# Altium schematic sheet Sheet_1_2022-01-13.schdoc
size 448 x 395 mm
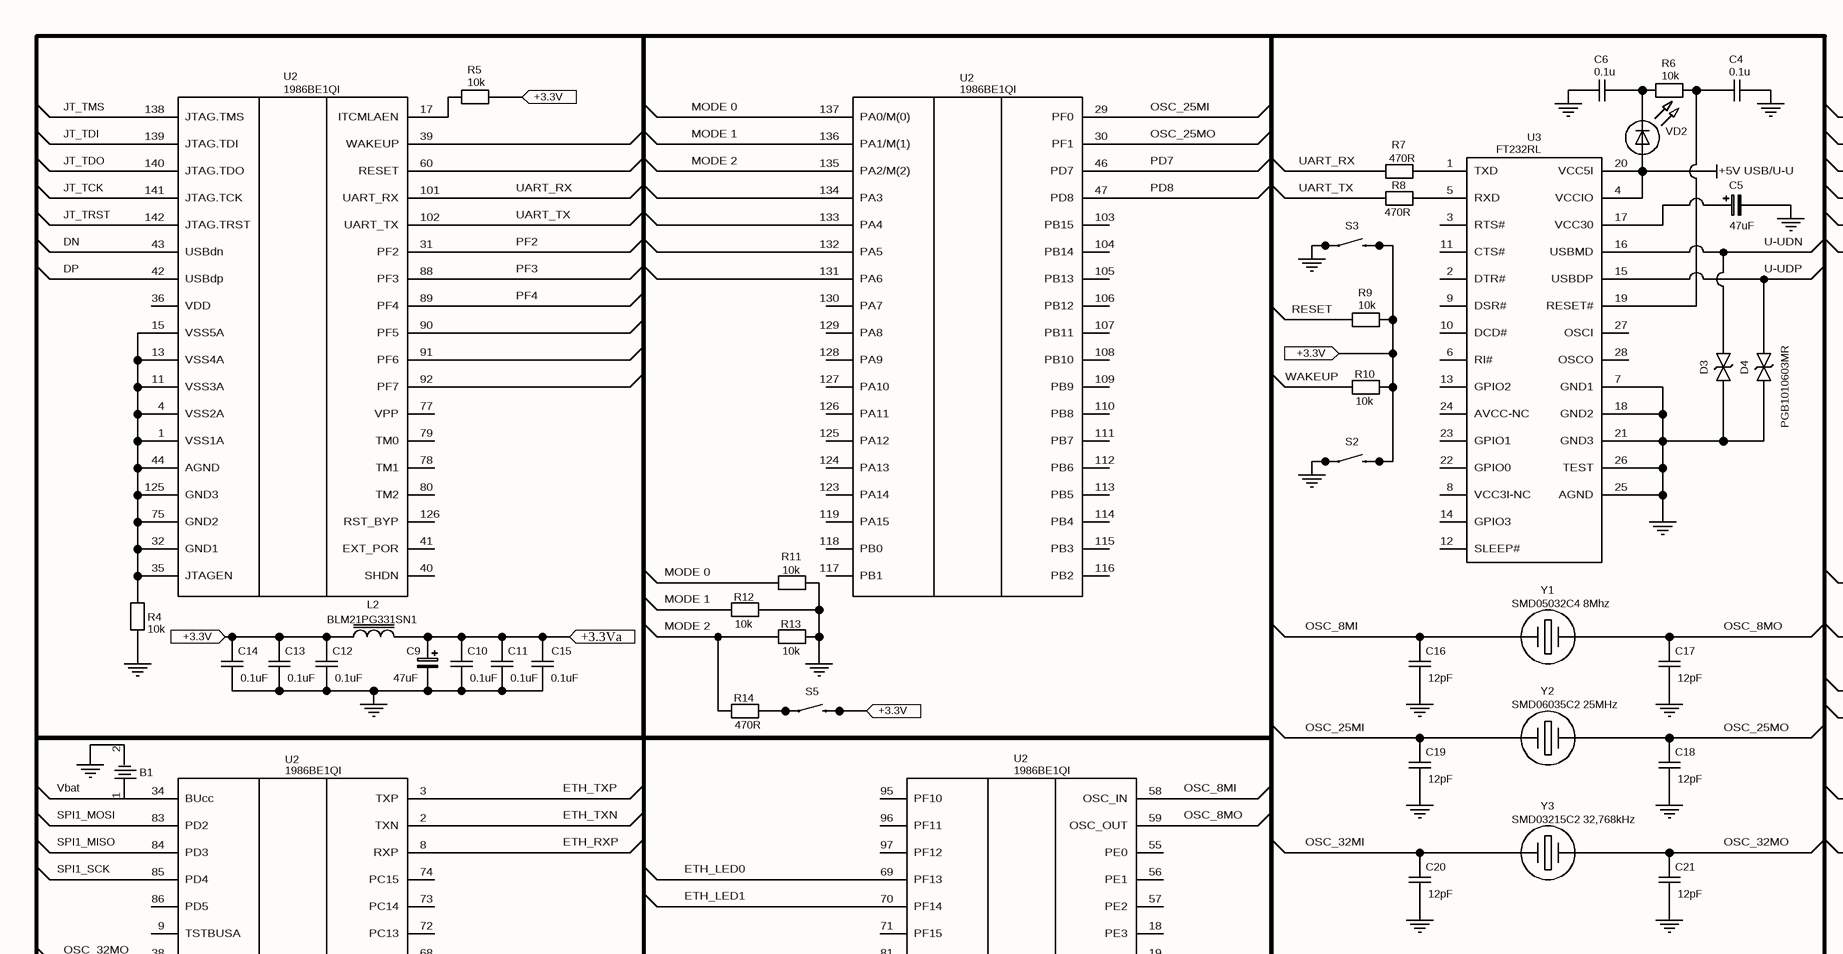
[diagram p0: Sheet_1_2022-01-13.schdoc, top left]
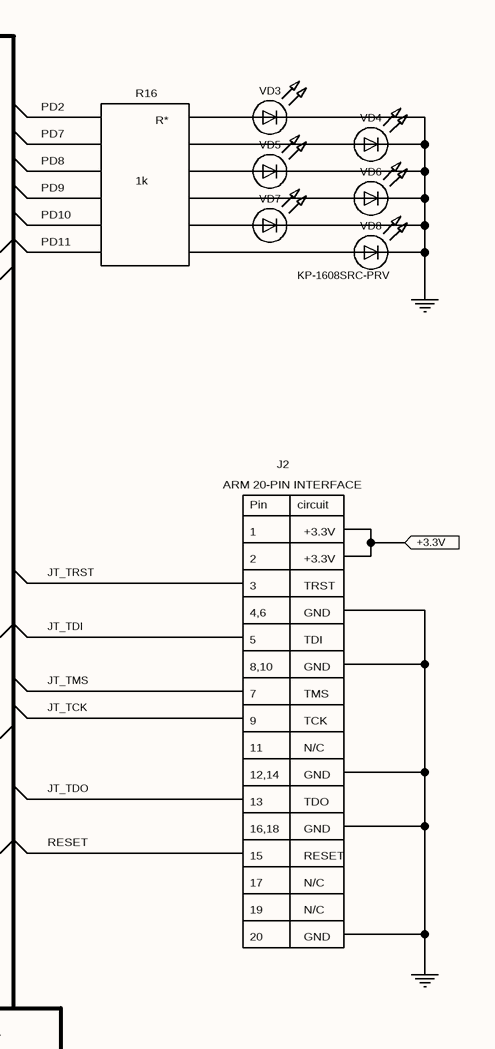
[diagram p1: Sheet_1_2022-01-13.schdoc, top right]
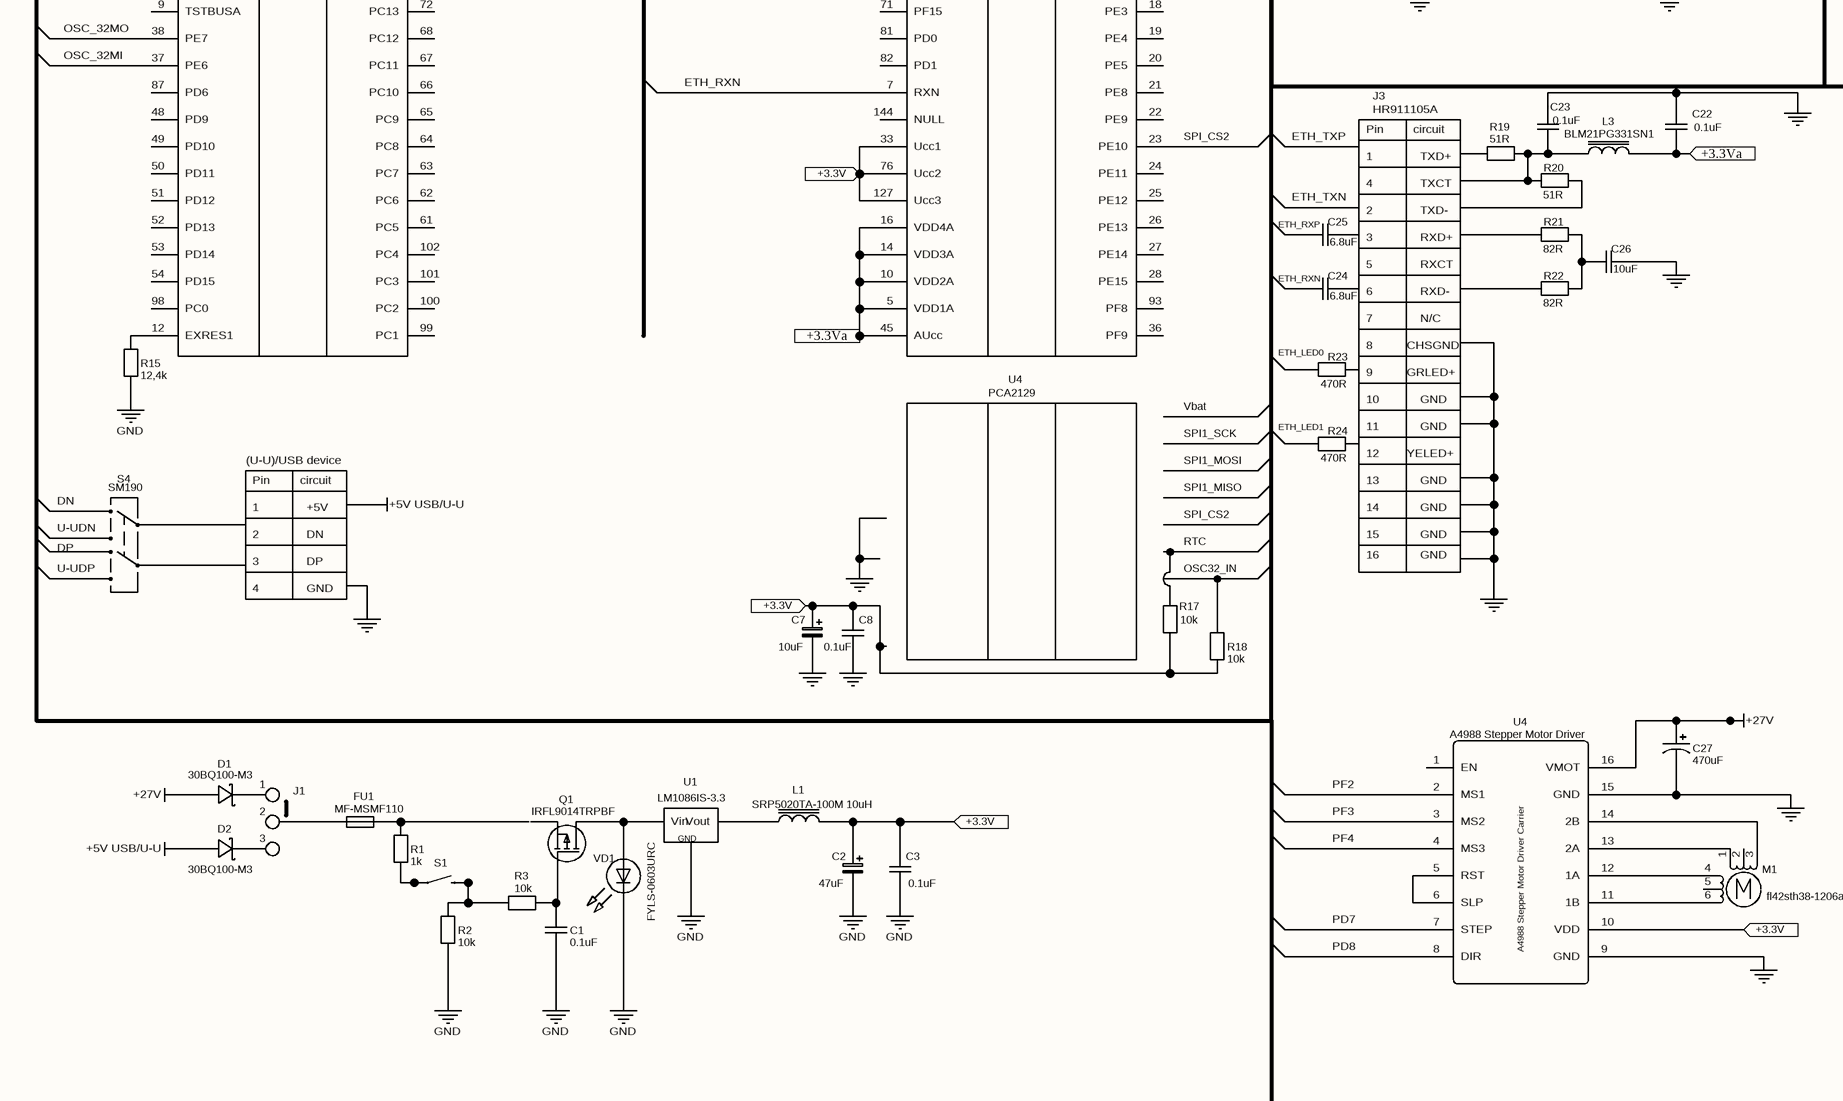
[diagram p2: Sheet_1_2022-01-13.schdoc, bottom left]
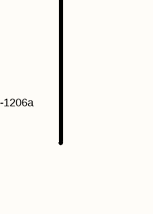
[diagram p3: Sheet_1_2022-01-13.schdoc, bottom right]

## Parts
(Parts that share a designator on the sheet are numbered #1, #2 ... from top to bottom, then left to right.)
B1  CR1220-2  [BAT-SMD_CR1220-2]  (value not drawn)
C1  0.1uF  [C0603]
C2  47uF  [CASE-A_3216]
C3  0.1uF  [C0603]
C4  0.1u  [C0603]
C5  47uF  [CASE-A_3216]
C6  0.1u  [C0603]
C7  10uF  [CASE-A_3216]
C8  0.1uF  [C0603]
C9  47uF  [CASE-A_3216]
C10  0.1uF  [C0603]
C11  0.1uF  [C0603]
C12  0.1uF  [C0603]
C13  0.1uF  [C0603]
C14  0.1uF  [C0603]
C15  0.1uF  [C0603]
C16  12pF  [C0603]
C17  12pF  [C0603]
C18  12pF  [C0603]
C19  12pF  [C0603]
C20  12pF  [C0603]
C21  12pF  [C0603]
C22  0.1uF  [C0603]
C23  0.1uF  [C0603]
C24  6.8uF  [C0603]
C25  6.8uF  [C0603]
C26  10uF  [C0603]
C27  470uF  [CASE-A_3216]
D1  30BQ100-M3  [SMC_L6.9-W5.9-LS7.9-RD]
D2  30BQ100-M3  [SMC_L6.9-W5.9-LS7.9-RD]
D3  PGB1010603MR  [D0603-BI]
D4  PGB1010603MR  [D0603-BI]  (value not drawn)
FU1  MF-MSMF110  [F1812]
L1  SRP5020TA-100M 10uH  [BOURNS_SRR0805]
L2  BLM21PG331SN1  [BOURNS_SRR0805]
L3  BLM21PG331SN1  [BOURNS_SRR0805]
M1  fl42sth38-1206a
Q1  IRFL9014TRPBF  [TO-220AB]
R1  1k  [R0603]
R2  10k  [R0603]
R3  10k  [R0603]
R4  10k  [R0603]
R5  10k  [R0603]
R6  10k  [R0603]
R7  470R  [R0603]
R8  470R  [R0603]
R9  10k  [R0603]
R10  10k  [R0603]
R11  10k  [R0603]
R12  10k  [R0603]
R13  10k  [R0603]
R14  470R  [R0603]
R15  12,4k  [R0603]
R17  10k  [R0603]
R18  10k  [R0603]
R19  51R  [R0603]
R20  51R  [R0603]
R21  82R  [R0603]
R22  82R  [R0603]
R23  470R  [R0603]
R24  470R  [R0603]
S1  SWITCH-MOMENTARY-2SMD-ALT01  [TACTILE-SWITCH-SMD-ALT01]  (value not drawn)
S2  SWITCH-MOMENTARY-2SMD-ALT01  [TACTILE-SWITCH-SMD-ALT01]  (value not drawn)
S3  SWITCH-MOMENTARY-2SMD-ALT01  [TACTILE-SWITCH-SMD-ALT01]  (value not drawn)
S4  SM190  [STOMP-SWITCH-DPDT]
S5  SWITCH-MOMENTARY-2SMD-ALT01  [TACTILE-SWITCH-SMD-ALT01]  (value not drawn)
U1  LM1086IS-3.3  [LM1086SI-3.3]
U2#1  1986BE1QI
U2#2  1986BE1QI
U2#3  1986BE1QI
U2#4  1986BE1QI
U3  FT232RL  [SSOP-28_150MIL]
U4  A4988 Stepper Motor Driver  [A4988 STEPPER MOTOR DRIVER CARRIER]
VD1  FYLS-0603URC  [LED-3MM/2.54]
VD2  FYLS-0603URC  [LED-3MM/2.54]  (value not drawn)
VD3  FYLS-0603URC  [LED-3MM/2.54]  (value not drawn)
VD4  FYLS-0603URC  [LED-3MM/2.54]  (value not drawn)
VD5  FYLS-0603URC  [LED-3MM/2.54]  (value not drawn)
VD6  FYLS-0603URC  [LED-3MM/2.54]  (value not drawn)
VD7  FYLS-0603URC  [LED-3MM/2.54]  (value not drawn)
VD8  FYLS-0603URC  [LED-3MM/2.54]  (value not drawn)
Y1  SMD05032C4 8Mhz  [RAD-0.1]
Y2  SMD06035C2 25MHz  [RAD-0.1]
Y3  SMD03215C2 32,768kHz  [RAD-0.1]

## Ports
+3.3V (in), +3.3Va (in)

## Nets
+5V USB/U-U: D2.2(A) U3.4(VCCIO) U3.20(VCC5I) VD2.1(A)
+27V: C27.1 D1.2(A) U4.16(VMOT)
GND: B1.2 C1.2 C2.2 C3.1 C4.2 C5.2 C6.1 C7.2 C8.1 C9.2 C10.1 C11.1 C12.1 C13.1 C14.1 C15.1 C16.1 C17.1 C18.1 C19.1 C20.1 C21.1 C22.2 C23.2 C26.2 C27.2 D3.1 D4.1 R2.2 R4.1 R11.2 R12.2 R13.2 R15.2 S2.1 S2.2 S3.1 S3.2 U1.?1(GND) U3.7(GND1) U3.18(GND2) U3.21(GND3) U3.25(AGND) U3.26(TEST) U4.9(GND) U4.15(GND) VD1.2(K) VD3.2(K) VD4.2(K) VD5.2(K) VD6.2(K) VD7.2(K) VD8.2(K)
+3.3V: C2.1 C3.2 C7.1 C8.2 C12.2 C13.2 C14.2 L1.2 L2.1 R5.1 R9.2 R10.2 R17.2 R18.2 S2.3 S2.4 S3.3 S3.4 S5.3 S5.4 U2#4.33(Ucc1) U2#4.76(Ucc2) U2#4.127(Ucc3) U4.10(VDD) ; port +3.3V
+3.3Va: C9.1 C10.2 C11.2 C15.2 C22.1 L2.2 L3.2 U2#4.5(VDD1A) U2#4.10(VDD2A) U2#4.14(VDD3A) U2#4.16(VDD4A) U2#4.45(AUcc) ; port +3.3Va
NetB1_1: B1.1 U2#3.34(BUcc)
NetC1_1: C1.1 Q1.1(G) R3.1
NetC4_1: C4.1 R6.2
NetC6_2: C6.2 R6.1 VD2.2(K)
NetC16_2: C16.2 Y1.2
NetC17_2: C17.2 Y1.1
NetC18_2: C18.2 Y2.1
NetC19_2: C19.2 Y2.2
NetC20_2: C20.2 Y3.2
NetC21_2: C21.2 Y3.1
NetC23_1: C23.1 L3.1 R19.1 R20.2
NetC26_1: C26.1 R21.1 R22.1
NetFU1_2: FU1.2 R1.1
NetL1_1: L1.1 U1.?2(Vout)
NetM1_1: M1.1 U4.13(2A)
NetM1_3: M1.3(-) U4.14(2B)
NetM1_4: M1.4 U4.12(1A)
NetM1_6: M1.6 U4.11(1B)
NetQ1_2: Q1.2(D) U1.?3(Vin) VD1.1(A)
NetR1_2: R1.2 S1.1 S1.2
NetR2_1: R2.1 R3.2 S1.3 S1.4
NetR4_2: R4.2 U2#1.1(VSS1A) U2#1.4(VSS2A) U2#1.11(VSS3A) U2#1.13(VSS4A) U2#1.15(VSS5A) U2#1.32(GND1) U2#1.35(JTAGEN) U2#1.44(AGND) U2#1.75(GND2) U2#1.125(GND3)
NetR5_2: R5.2 U2#1.17(ITCMLAEN)
NetR7_2: R7.2 U3.1(TXD)
NetR8_2: R8.2 U3.5(RXD)
NetR13_1: R13.1 R14.1
NetR14_2: R14.2 S5.1 S5.2
NetR15_1: R15.1 U2#3.12(EXRES1)
NetU4_5: U4.5(RST) U4.6(SLP)

Not connected (* = marked no-connect by the designer): C5 1; C24 1 2; C25 1 2; D1 1(C); D2 1(C); D3 2; D4 2; FU1 1; M1 2 5; Q1 3(S); R7 1; R8 1; R9 1; R10 1; R11 1; R12 1; R17 1; R18 1; R19 2; R20 1; R21 2; R22 2; R23 1 2; R24 1 2; S4 P$1(1) P$2(2) P$3(3) P$4(4) P$5(5) P$6(6); U2#1 31(PF2) 36(VDD) 39(WAKEUP) 40(SHDN) 41(EXT_POR) 42(USBdp) 43(USBdn) 60(RESET) 77(VPP) 78(TM1) 79(TM0) 80(TM2) 88(PF3) 89(PF4) 90(PF5) 91(PF6) 92(PF7) 101(UART_RX) 102(UART_TX) 126(RST_BYP) 138(JTAG.TMS) 139(JTAG.TDI) 140(JTAG.TDO) 141(JTAG.TCK) 142(JTAG.TRST); U2#2 29(PF0) 30(PF1) 46(PD7) 47(PD8) 103(PB15) 104(PB14) 105(PB13) 106(PB12) 107(PB11) 108(PB10) 109(PB9) 110(PB8) 111(PB7) 112(PB6) 113(PB5) 114(PB4) 115(PB3) 116(PB2) 117(PB1) 118(PB0) 119(PA15) 123(PA14) 124(PA13) 125(PA12) 126(PA11) 127(PA10) 128(PA9) 129(PA8) 130(PA7) 131(PA6) 132(PA5) 133(PA4) 134(PA3) 135(PA2/M(2)) 136(PA1/M(1)) 137(PA0/M(0)); U2#3 2(TXN) 3(TXP) 8(RXP) 9(TSTBUSA) 37(PE6) 38(PE7) 48(PD9) 49(PD10) 50(PD11) 51(PD12) 52(PD13) 53(PD14) 54(PD15) 61(PC5) 62(PC6) 63(PC7) 64(PC8) 65(PC9) 66(PC10) 67(PC11) 68(PC12) 72(PC13) 73(PC14) 74(PC15) 83(PD2) 84(PD3) 85(PD4) 86(PD5) 87(PD6) 98(PC0) 99(PC1) 100(PC2) 101(PC3) 102(PC4); U2#4 7(RXN) 18(PE3) 19(PE4) 20(PE5) 21(PE8) 22(PE9) 23(PE10) 24(PE11) 25(PE12) 26(PE13) 27(PE14) 28(PE15) 36(PF9) 55(PE0) 56(PE1) 57(PE2) 58(OSC_IN) 59(OSC_OUT) 69(PF13) 70(PF14) 71(PF15) 81(PD0) 82(PD1) 93(PF8) 95(PF10) 96(PF11) 97(PF12) 144(NULL); U3 2(DTR#) 3(RTS#) 6(RI#) 8(VCC3I-NC) 9(DSR#) 10(DCD#) 11(CTS#) 12(SLEEP#) 13(GPIO2) 14(GPIO3) 15(USBDP) 16(USBMD) 17(VCC30) 19(RESET#) 22(GPIO0) 23(GPIO1) 24(AVCC-NC) 27(OSCI) 28(OSCO); U4 1(EN) 2(MS1) 3(MS2) 4(MS3) 7(STEP) 8(DIR); VD3 1(A); VD4 1(A); VD5 1(A); VD6 1(A); VD7 1(A); VD8 1(A)

## Notes on the sheet
- JT_TMS
- JT_TDI
- MODE 0
- MODE 1
- OSC_25MI
- OSC_25MO
- PD2
- PD7
- R16
- R*
- JT_TDO
- JT_TCK
- JT_TRST
- UART_RX
- UART_TX
- MODE 2
- PD8
- PD9
- PD10
- 1k
- DN
- DP
- PF2
- PF3
- U-UDP
- (near C5) U-UDN
- PD11
- (near VD8) KP-1608SRC-PRV
- PF4
- (near R9) RESET
- (near R10) WAKEUP
- ARM 20-PIN INTERFACE
- J2
- 1
- Pin
- circuit
- +3.3V
- (near R12) MODE 0
- (near R12) MODE 1
- 3
- 2
- 4,6
- GND
- TRST
- (near R12) MODE 2
- OSC_8MI
- OSC_8MO
- 5
- 8,10
- TDI
- 7
- 9
- 11
- TMS
- TCK
- N/C
- (near B1) Vbat
- (near B1) SPI1_MOSI
- ETH_TXN
- ETH_TXP
- (near U2#4) OSC_8MI
- (near U2#4) OSC_8MO
- 12,14
- 13
- TDO
- SPI1_SCK
- SPI1_MISO
- ETH_RXP
- ETH_LED0
- OSC_32MI
- OSC_32MO
- RESET
- 16,18
- 15
- 17
- ETH_LED1
- 19
- 20
- ETH_RXN
- J3
- (near U2#4) SPI_CS2
- HR911105A
- (near R19) circuit
- (near R19) TXD+
- (near C25) ETH_RXP
- (near C25) ETH_TXN
- (near C25) 3
- (near C25) 4
- (near C25) 2
- (near R19) TXCT
- TXD-
- RXD+
- (near C24) ETH_RXN
- (near C24) 6
- RXCT
- RXD-
- (near R23) ETH_LED0
- (near R23) 9
- (near R23) 8
- GRLED+
- CHSGND
- (near U2#4) PCA2129
- (near U2#4) U4
- Vbat
- (near R24) ETH_LED1
- (near R24) 11
- 10
- (near S4) DN
- (U-U)/USB device
- +5V
- SPI1_MOSI
- 14
- (near R24) 13
- (near R24) 12
- YELED+
- (near S4) DP
- (near S4) U-UDN
- (near S4) U-UDP
- RTC
- (near R17) OSC32_IN
- SPI_CS2
- 16
- 4
- (near D1) 1
- (near D2) 3
- J1

## Library data of the parts
B1 = CR1220-2: BOM_Manufacturer: Q&J; BOM_Supplier: LCSC; BOM_Manufacturer Part: CR1220-2; image: //image.lceda.cn/szlcsc/C70381.jpg; BOM_Supplier Part: C70381; spicePre: B; spiceSymbolName: CR1220-2
C1 C3 C8 C10-C15 C22 C23 = 0.1uF: nameAlias: Value(F); Contributor: LCEDA_Lib; spicePre: C; spiceSymbolName: C_0603_US
C2 C5 C9 = 47uF: nameAlias: Value(F); Contributor: LCEDA_Lib; spicePre: C; spiceSymbolName: C_Tan_SMD_A_EU
C4 C6 = 0.1u: nameAlias: Value(F); Contributor: LCEDA_Lib; spicePre: C; spiceSymbolName: C_0603_US
C7 C26 = 10uF: nameAlias: Value(F); Contributor: LCEDA_Lib; spicePre: C
  C7: spiceSymbolName: C_Tan_SMD_A_EU
  C26: spiceSymbolName: C_0603_US
C16-C21 = 12pF: nameAlias: Value(F); Contributor: LCEDA_Lib; spicePre: C; spiceSymbolName: C_0603_US
C24 C25 = 6.8uF: nameAlias: Value(F); Contributor: LCEDA_Lib; spicePre: C; spiceSymbolName: C_0603_US
C27 = 470uF: nameAlias: Value(F); Contributor: LCEDA_Lib; spicePre: C; spiceSymbolName: C_Tan_SMD_A_US
D1 D2 = 30BQ100-M3: BOM_Manufacturer: Vishay Intertech; BOM_Manufacturer Part: VS-30BQ100-M3/9AT; Contributor: LCSC; BOM_Supplier: LCSC; BOM_Supplier Part: C435959; BOM_JLCPCB Part Class: Extended Part; spicePre: D; spiceSymbolName: VS-30BQ100-M3/9AT
D3 D4 = PGB1010603MR: BOM_Manufacturer: Littelfuse; Contributor: LCSC; BOM_Supplier: LCSC; BOM_Supplier Part: C142698; BOM_Manufacturer Part: PGB1010603MR; BOM_JLCPCB Part Class: Extended Part; spicePre: D; spiceSymbolName: PGB1010603MR
FU1 = MF-MSMF110: BOM_Manufacturer: BOURNS; BOM_Manufacturer Part: MF-MSMF110/16-2; Contributor: LCSC; BOM_Supplier: LCSC; BOM_Supplier Part: C210834; BOM_JLCPCB Part Class: Extended Part; spicePre: F; spiceSymbolName: MF-MSMF110/16-2
M1 = fl42sth38-1206a: Contributor: KiCAD; license: https://www.gnu.org/licenses/lgpl-2.1.html; spicePre: M; spiceSymbolName: Stepper_Motor_unipolar_6pin
Q1 = IRFL9014TRPBF: description: HEXFET Power MOSFET; Contributor: IgrikXD; spicePre: Q; spiceSymbolName: P-канальный полевой транзистор ГОСТ copy copy
R1 = 1k: nameAlias: Value(Ω); Contributor: LCEDA_Lib; spicePre: R; spiceSymbolName: R_0603_EU
R2-R6 R9-R13 R17 R18 = 10k: nameAlias: Value(Ω); Contributor: LCEDA_Lib; spicePre: R; spiceSymbolName: R_0603_EU
R7 R8 R14 R23 R24 = 470R: nameAlias: Value(Ω); Contributor: LCEDA_Lib; spicePre: R; spiceSymbolName: R_0603_EU
R15 = 12,4k: nameAlias: Value(Ω); Contributor: LCEDA_Lib; spicePre: R; spiceSymbolName: R_0603_EU
R19 R20 = 51R: nameAlias: Value(Ω); Contributor: LCEDA_Lib; spicePre: R; spiceSymbolName: R_0603_EU
R21 R22 = 82R: nameAlias: Value(Ω); Contributor: LCEDA_Lib; spicePre: R; spiceSymbolName: R_0603_EU
S1-S3 S5 = SWITCH-MOMENTARY-2SMD-ALT01: Contributor: Night67; spicePre: S; spiceSymbolName: SWITCH-MOMENTARY-2SMD-ALT01
S4 = SM190: Contributor: SparkFun; spicePre: S; spiceSymbolName: SWITCH-DPDT
U1 = LM1086IS-3.3: Contributor: al.vishnikin; BOM_Manufacturer Part: LM1086IS-3.3; link: http://www.ti.com/lit/ds/symlink/lm1086.pdf; spicePre: U; spiceSymbolName: LM1086IS-3.3
U2#1-U2#4 = 1986BE1QI: nameAlias: Model; catid: 20; Contributor: Xlopinus; sim: true; spicePre: X; BOM_Supplier: LCSC; spiceSymbolName: 1986BE1QI
U3 = FT232RL: nameAlias: Model; catid: 20; Contributor: Xlopinus; sim: true; spicePre: X; spiceSymbolName: FT232RL
U4 = A4988 Stepper Motor Driver: Contributor: winter2015; sourceId: YsmgyP7pj; timeStamp: 1453298166; spicePre: U; spiceSymbolName: A4988 Stepper Motor Driver Carrier
VD1-VD8 = FYLS-0603URC: BOM_Manufacturer: EVERLIGHT; BOM_Manufacturer Part: 204-10SURD/S530-A3; Contributor: IgrikXD; BOM_Supplier Part: C99772; BOM_Supplier: LCSC; spicePre: L; spiceSymbolName: Светодиод ГОСТ copy
Y1 = SMD05032C4 8Mhz: BOM_Manufacturer Part: SQ; Contributor: cowboyaid68; Capacitance: 32768 Гц; sim: true; BOM_Supplier: YUJING; spicePre: C; spiceSymbolName: Quartz resonator
Y2 = SMD06035C2 25MHz: BOM_Manufacturer Part: SQ; Contributor: cowboyaid68; Capacitance: 32768 Гц; sim: true; BOM_Supplier: YUJING; spicePre: C; spiceSymbolName: Quartz resonator
Y3 = SMD03215C2 32,768kHz: BOM_Manufacturer Part: SQ; Contributor: cowboyaid68; Capacitance: 32768 Гц; sim: true; BOM_Supplier: YUJING; spicePre: C; spiceSymbolName: Quartz resonator
L1 = SRP5020TA-100M 10uH: spicePre: L; spiceSymbolName: US_BOURNS_SRR0805-561K
L2 L3 = BLM21PG331SN1: spicePre: L; spiceSymbolName: US_BOURNS_SRR0805-561K